# Altium schematic sheet high_fre_amp.SchDoc: High frequncy Amplifier
size A3; SheetNumber: 1; SheetTotal: 1
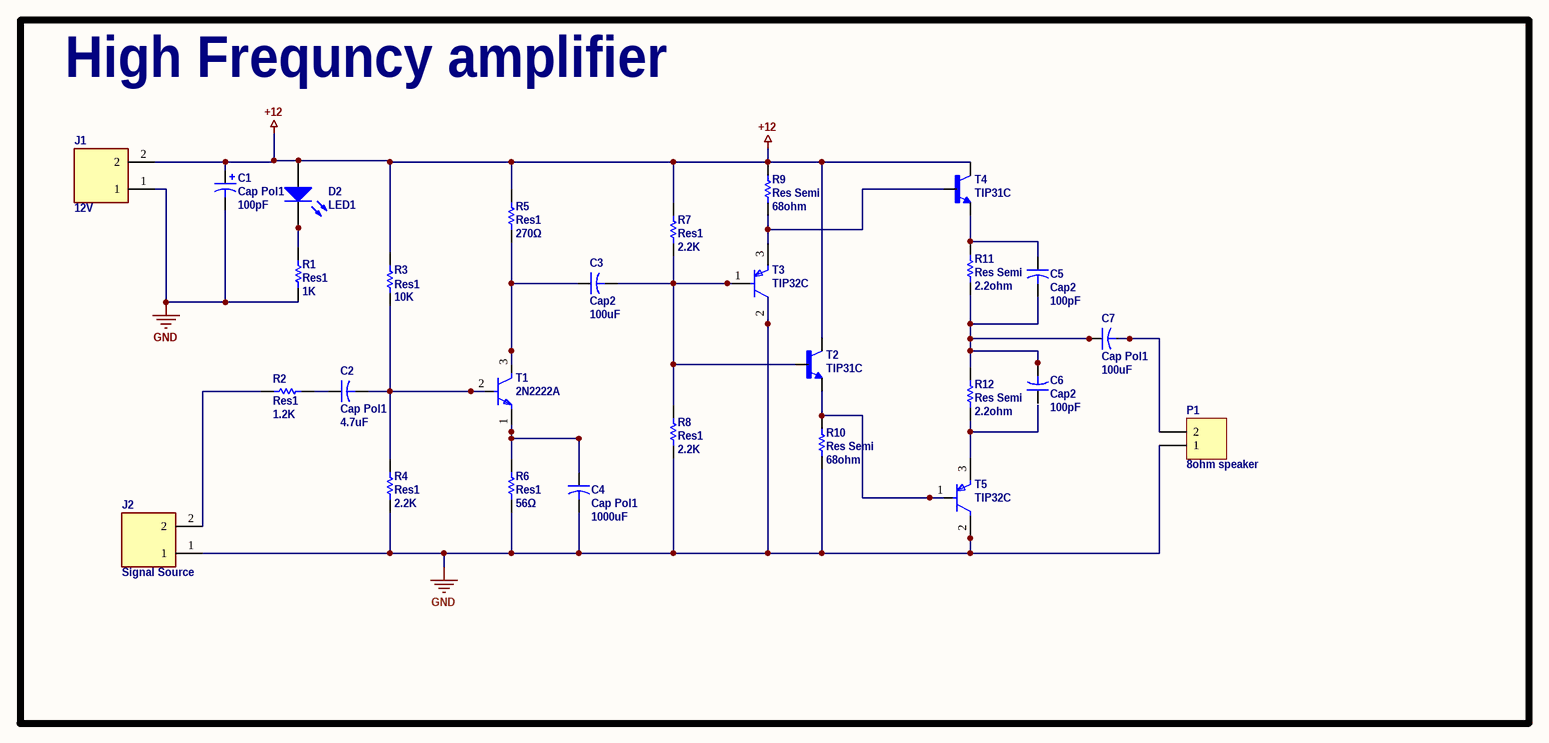
[diagram p0: high_fre_amp.SchDoc]

## Parts
C1  Cap Pol1  value 100pF  [RB7.6-15]
C2  Cap Pol1  value 4.7uF  [RB7.6-15]
C3  Cap2  value 100uF  [CAPR5-4X5]
C4  Cap Pol1  value 1000uF  [RB7.6-15]
C5  Cap2  value 100pF  [CAPR5-4X5]
C6  Cap2  value 100pF  [CAPR5-4X5]
C7  Cap Pol1  value 100uF  [RB7.6-15]
D2  LED1  [LED-1]
J1  12V  [HANDSON_KF301-2P]
J2  Signal Source  [HANDSON_KF301-2P]
P1  8ohm speaker  [HDR1X2]
R1  Res1  value 1K  [AXIAL-0.3]
R2  Res1  value 1.2K  [AXIAL-0.3]
R3  Res1  value 10K  [AXIAL-0.3]
R4  Res1  value 2.2K  [AXIAL-0.3]
R5  Res1  value 270Ω  [AXIAL-0.3]
R6  Res1  value 56Ω  [AXIAL-0.3]
R7  Res1  value 2.2K  [AXIAL-0.3]
R8  Res1  value 2.2K  [AXIAL-0.3]
R9  Res Semi  value 68ohm  [AXIAL-0.5]
R10  Res Semi  value 68ohm  [AXIAL-0.5]
R11  Res Semi  value 2.2ohm  [AXIAL-0.5]
R12  Res Semi  value 2.2ohm  [AXIAL-0.5]
T1  2N2222A  [FP-2N2222A-MFG]
T2  TIP31C  [TO220]
T3  TIP32C  [FP-TO-220-P0A0015988-MFG]
T4  TIP31C  [TO220]
T5  TIP32C  [FP-TO-220-P0A0015988-MFG]

## Blocks framed on the sheet
High Frequncy amplifier: C1-C7 D2 J1 J2 P1 R1-R12 T1-T5

## Nets
+12: C1.1 D2.1(A) J1.2 R3.2 R5.2 R7.2 R9.2 T2.2(C) T4.2(C)
GND: C1.2 C4.2 J1.1 J2.1 P1.1 R1.2 R4.1 R6.1 R8.1 R10.1 T3.2(C) T5.2(C)
NetC2_1: C2.1 R2.2
NetC2_2: C2.2 R3.1 R4.2 T1.2(B)
NetC3_1: C3.1 R5.1 T1.3(C)
NetC3_2: C3.2 R7.1 R8.2 T2.1(B) T3.1(B)
NetC4_1: C4.1 R6.2 T1.1(E)
NetC5_1: C5.1 R11.2 T4.3(E)
NetC5_2: C5.2 C6.2 C7.1 R11.1 R12.2
NetC7_2: C7.2 P1.2
NetD2_2: D2.2(K) R1.1
NetJ2_2: J2.2 R2.1
NetR9_1: R9.1 T3.3(E) T4.1(B)
NetR10_2: R10.2 T2.3(E) T5.1(B)
NetR12_1: R12.1 T5.3(E)

Not connected (* = marked no-connect by the designer): C6 1

## Notes on the sheet
- Title:
- Auther:
- L.H.H.Maduwantha
- Size:
- A3
- Date:
- File:
- Time:
- Sheet
- Of

## Library data of the parts
C1 = Cap Pol1: Polarized Capacitor (Radial); Published: 8-Jun-2000; LatestRevisionDate: 17-Jul-2002; LatestRevisionNote: Re-released for DXP Platform.; PackageReference: RB7.6-15; Publisher: Altium Limited; PackageDescription: Polarized Capacitor (Radial); 2 Leads
C2-C7 = Cap2: Capacitor; Published: 23-Sep-2002; PackageReference: CAPR5-4X5; Publisher: Altium Limited; PackageDescription: Capacitor; 2 Leads
D2 = LED1: Typical RED GaAs LED; Published: 8-Jun-2000; LatestRevisionDate: 08-Jul-2005; LatestRevisionNote: Mech Layer 1 removed.; PackageReference: LED-1; Publisher: Altium Limited; PackageDescription: LED; 2 Leads
J1 J2 = KF301-2P: 2 Pin Terminal Block 5mm Pitch; Price: None; Value: *; MP: KF301-2P; Package: None; Availability: Unavailable
P1 = Header 2: Header, 2-Pin; LatestRevisionDate: 17-Jul-2002; LatestRevisionNote: Re-released for DXP Platform.; Publisher: Altium Limited
R1-R8 = Res1: Resistor; Published: 8-Jun-2000; LatestRevisionDate: 17-Jul-2002; LatestRevisionNote: Re-released for DXP Platform.; PackageReference: AXIAL-0.3; Publisher: Altium Limited; PackageDescription: Axial Device, Thru-Hole; 2 Leads; 0.3 in Pin Spacing
R9-R12 = Res Semi: Semiconductor Resistor; Published: 8-Jun-2000; LatestRevisionDate: 17-Jul-2002; LatestRevisionNote: Re-released for DXP Platform.; PackageReference: AXIAL-0.5; Publisher: Altium Limited; PackageDescription: Axial Device, Thru-Hole; 2 Leads; 0.5 in Pin Spacing
T1 = CMP-50385-000001-1: T-NPN SI- AUDIO VHF AMP; Max Power Dissipation: 1.2W; Collector Emitter Breakdown Voltage: 40V; Transition Frequency: 300MHz; Polarity: NPN; Collector Emitter Voltage (VCEO): 40V; Lead Free: Contains Lead; Max Operating Temperature: 200°C; REACH SVHC: No SVHC; Case/Package: TO-18; Number of Pins: 3
T2 T4 = TIP31C: Transistor bipolar (BJT) NPN 100 V 3 A 3 MHz 2 W Orificio pasante TO-220-3; MF: ON Semiconductor; Value: *; MP: TIP31C; Package: TO-220-3 ON; Check_prices: https://www.snapeda.com/parts/TIP31C/Onsemi/view-part/?ref=eda; SnapEDA_Link: https://www.snapeda.com/parts/TIP31C/Onsemi/view-part/?ref=snap; Digi-Key_Part_Number: TIP31COS-ND; Purchase-URL: https://pricing.snapeda.com/search/part/TIP31C/?ref=eda
T3 T5 = CMP-12195-000005-1: TRANS PNP 100V 3A TO-220; Manufacturer: STMicroelectronics; Standoff Height: 3.5mm; Number Of Pnp: 1; Max Collector Current: -3A; Emitter Base Voltage: -5V; Collector Emitter Voltage: -100V; Hfe Testvce: -4V; Hfe Max: 50; Collector Emitter Saturation Voltage: -1.2V; Power Dissipation: 2W; Max Junction Temp: +150°C; Hfe Min: 10; Device Class L3: BJTs; Mouser Description: Original ST Microelectronics Transistor, 100V, 3A, .22 Ohm, TO-220 Package; ComponentLink2Description: Datasheet; Device Class L1: Discrete Semiconductors; Automotive: No; Number Of Elements: 1; Category: Trans; Collector Base Voltage: -100V; Package: TO-220-P0A0015988; Height: 19.68mm; Lead Free: Yes; ComponentLink2URL: https://www.st.com/resource/en/datasheet/tip32c.pdf; Hfe Testic: -3A; RoHS: TRUE; Temperature Range High: +150°C; Temperature: to +150°C; Device Class L2: Transistors; Digikey Description: TRANS PNP 100V 3A TO-220; Octopart: https://octopart.com/tip32c-stmicroelectronics-353617; Manufacturer Part Number: TIP32C